# Altium project V regulate.PrjPcb
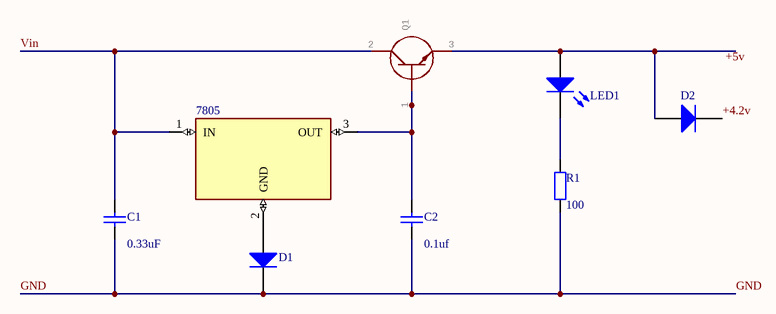
[diagram p0: Sheet1.SchDoc]
1 sheet, 8 parts. Net scope: global (net labels, ports and power ports of the same name join across sheets).
Board file: PCB1.PcbDoc

## Sheet Sheet1.SchDoc
size A; SheetNumber: 1; SheetTotal: 1; SPICEModelCacheJWNYOHSY: <root> / <DocumentId>JWNYOHSY</DocumentId> / <CacheFrame Number="0"> / <Model Name="1n4007" Kind="MDL"> / <Text>*1N4007 MCE 8-16-95 / *1000V 1A Si GenPurpose Diode pkg:DIODE0.4 1,2 / .MODEL 1N4007 D(IS=2.55E-9 RS=0.042 N=1.75 TT=5.76E-6 CJO=1.85E-11 / + VJ=0.75 M=0.333 BV=1000 IBV=9.86E-5 )</Text> / </Model> / <Model Name="cap" Kind="MDL"> / <Text>*Default semiconductor capacitor / .MODEL CAP C()</Text> / </Model> / </CacheFrame> / </root>

### Parts
7805  LM7805  [TO220]  (value not drawn)
C1  value 0.33uF  [RAD-0.3]  (hidden comment: Cap)
C2  value 0.1uf  [RAD-0.3]  (hidden comment: Cap)
D1  Diode 1N4007  [DO-41]  (value not drawn)
D2  Diode 1N4007  [DO-41]  (value not drawn)
Q1  (no value)  [TO304P498X1010X2089-3P]
R1  value 100  [AXIAL-0.4]  (hidden comment: Res2)
  LED1  [LED-1]

### Nets
+4.2v: D2.2(K)
GND: C1.1 C2.1 D1.2(K) R1.1
Vin: 7805.1(IN) C1.2 Q1.2(C)
Net7805_2: 7805.2(GND) D1.1(A)
Net7805_3: 7805.3(OUT) C2.2 Q1.1(B)
NetD2_1: D2.1(A) Q1.3(E) .1(A)
NetR1_2: R1.2 .2(K)

### Notes on the sheet
- Labels drawn without touching a wire or pin:  +5v

### Library data of the parts
C1 C2 = Cap: Capacitor; Published: 8-Jun-2000; LatestRevisionDate: 17-Jul-2002; LatestRevisionNote: Re-released for DXP Platform.; PackageReference: RAD-0.3; Publisher: Altium Limited; PackageDescription: Radial Cap, Thru-Hole; 2 Leads; 0.3 in Pin Spacing
D1 D2 = Diode 1N4007: 1 Amp General Purpose Rectifier; Published: 8-Jun-2000; LatestRevisionDate: 17-Jul-2002; LatestRevisionNote: Re-released for DXP Platform.; DatasheetVersion: 1998; PackageVersion: Aug-1999; PackageReference: DO-41; Publisher: Altium Limited; PackageDescription: Diode, Axial; Body 5.2 x 2.7 mm (LxDia. max), Lead Dia. 0.86 mm (max); Code_JEDEC: DO-204-AL; ComponentLink1Description: Manufacturer Link; ComponentLink1URL: http://www.fairchildsemi.com/; ComponentLink2Description: Datasheet; ComponentLink2URL: http://www.fairchildsemi.com/ds/1N%2F1N4001.pdf
Q1 = 2SD313: Manufacturer_Name: MOSPEC; GateName_1: G$1; SymbolName_1: 2SD313; LibraryName: 2SD313; DeviceSetName: 2SD313; Package: TO304P498X1010X2089-3P; Manufacturer_Part_Number: 2SD313; Height: 4.98mm
R1 = Res2: Resistor; Published: 8-Jun-2000; LatestRevisionDate: 17-Jul-2002; LatestRevisionNote: Re-released for DXP Platform.; PackageReference: AXIAL-0.4; Publisher: Altium Limited; PackageDescription: Axial Device, Thru-Hole; 2 Leads; 0.4 in Pin Spacing
7805 = LM7805: Package: None; Availability: Unavailable; Value: *; MP: LM7805; Price: None
 = LED1: Typical RED GaAs LED